# Altium schematic sheet SZG-TEMPLATE-STD.SchDoc: SZG-TEMPLATE-STD
size B; Organization: Opal Kelly; Address1: 13500 SW 72nd Ave STE 100; Address2: Portland, OR  97223; Address3: 217.391.3724; Address4: http://www.opalkelly.com; DocumentNumber: xxx; Revision: 1; SheetNumber: 2; SheetTotal: 3; PageSetup: Record=PageOptions|CenterHorizontal=True|CenterVertical=True|PrintScale=0.52|XCorrection=1.00|YCorrection=1.00|PrintKind=0|BorderSize=5000000|LeftOffset=0|BottomOffset=0|Orientation=2|PaperLength=1000|PaperWidth=1000|Scale=100|PaperSource=7|PrintQuality=-4|MediaType=1|DitherType=10|PaperKind=Letter|PrintScaleMode=1
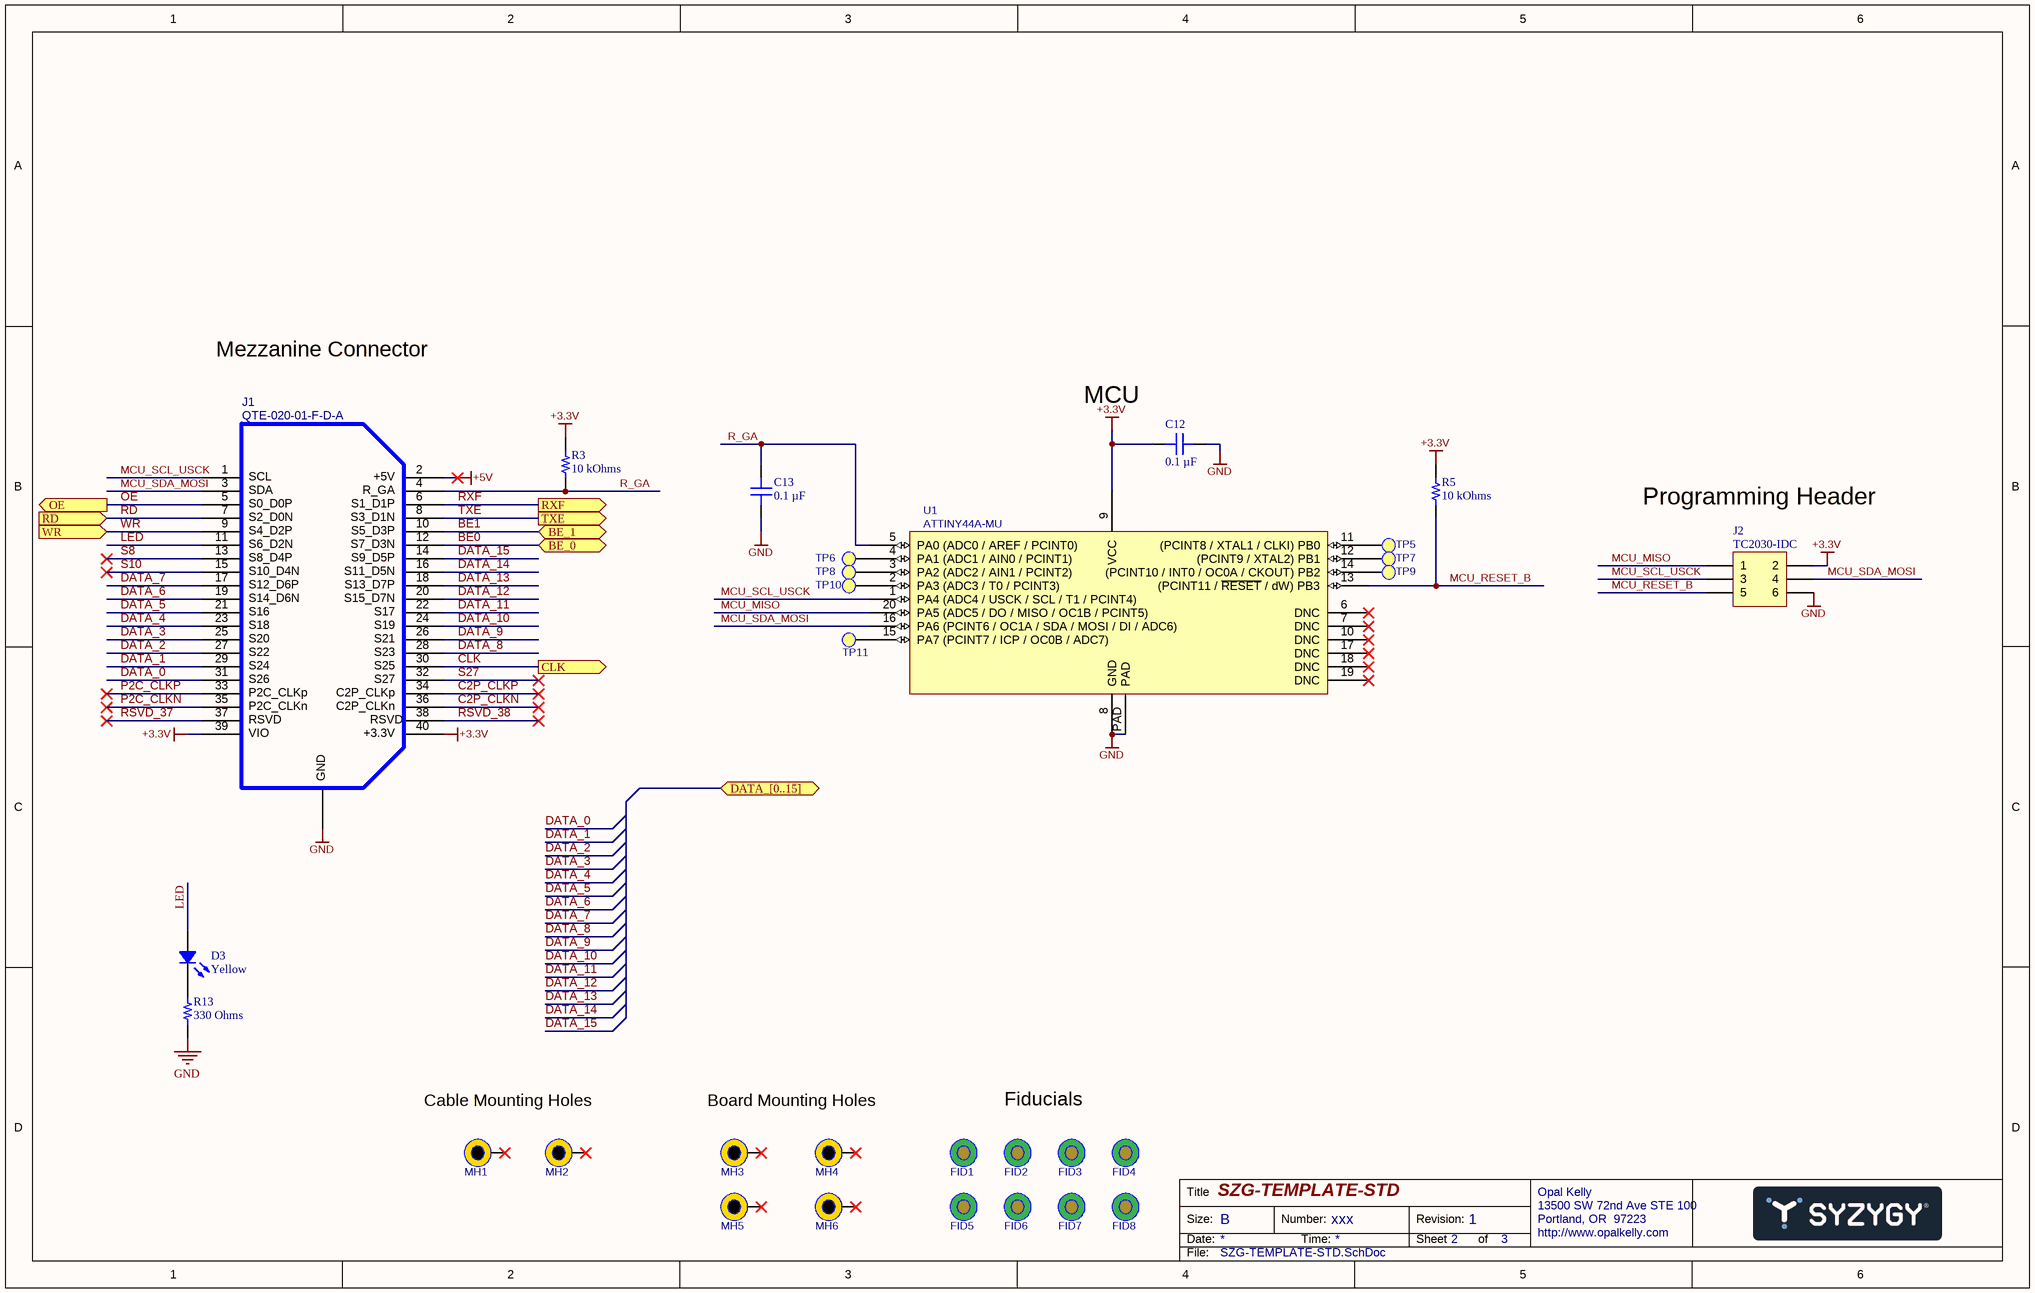
[diagram p0: SZG-TEMPLATE-STD.SchDoc]

## Parts
C12  0.1 µF  [CAP 0201_0603]
C13  0.1 µF  [CAP 0201_0603]
D3  Yellow  [LED 1206_3216 YELLOW]
FID1  FIDUCIAL  [FID1MM/2MM-SS]  (value not drawn)
FID2  FIDUCIAL  [FID1MM/2MM-SS]  (value not drawn)
FID3  FIDUCIAL  [FID1MM/2MM-SS]  (value not drawn)
FID4  FIDUCIAL  [FID1MM/2MM-SS]  (value not drawn)
FID5  FIDUCIAL  [FID1MM/2MM-SS]  (value not drawn)
FID6  FIDUCIAL  [FID1MM/2MM-SS]  (value not drawn)
FID7  FIDUCIAL  [FID1MM/2MM-SS]  (value not drawn)
FID8  FIDUCIAL  [FID1MM/2MM-SS]  (value not drawn)
J1  QTE-020-01-F-D-A  [QTE-020-01-X-D-A-L]
J2  Manufacturer_PN: TC2030-IDC  [TC2030-DUAL]
MH1  MTG  [MTG-3.2/6.5-PTH]  (value not drawn)
MH2  MTG  [MTG-3.2/6.5-PTH]  (value not drawn)
MH3  MTG  [MTG-3.2/6.5-PTH]  (value not drawn)
MH4  MTG  [MTG-3.2/6.5-PTH]  (value not drawn)
MH5  MTG  [MTG-3.2/6.5-PTH]  (value not drawn)
MH6  MTG  [MTG-3.2/6.5-PTH]  (value not drawn)
R3  10 kOhms  [RES 0201_0603]
R5  10 kOhms  [RES 0201_0603]
R13  330 Ohms  [RES 0603_1608]
TP5  TESTPOINT-SMD20  [TP-SMD20]  (value not drawn)
TP6  TESTPOINT-SMD20  [TP-SMD20]  (value not drawn)
TP7  TESTPOINT-SMD20  [TP-SMD20]  (value not drawn)
TP8  TESTPOINT-SMD20  [TP-SMD20]  (value not drawn)
TP9  TESTPOINT-SMD20  [TP-SMD20]  (value not drawn)
TP10  TESTPOINT-SMD20  [TP-SMD20]  (value not drawn)
TP11  TESTPOINT-SMD20  [TP-SMD20]  (value not drawn)
U1  ATTINY44A-MU  [QFN-EP-20]

## Ports
BE_0 (bidir), BE_1 (bidir), CLK (out), DATA_[0..15] (bidir), OE (out), RD (in), RXF (out), TXE (out), WR (in)

## Nets
+3.3V: C12.1 J1.39 J1.40 J2.2 R3.2 R5.2 U1.9(VCC)
+5V: J1.2
GND: C12.2 C13.1 J1.0 J2.6 R13.1 U1.8(GND) U1.PAD
BE0: J1.12 ; port BE_0
BE1: J1.10 ; port BE_1
C2P_CLKN: J1.36
C2P_CLKP: J1.34
CLK: J1.30 ; port CLK
DATA_0: J1.31
DATA_1: J1.29
DATA_2: J1.27
DATA_3: J1.25
DATA_4: J1.23
DATA_5: J1.21
DATA_6: J1.19
DATA_7: J1.17
DATA_8: J1.28
DATA_9: J1.26
DATA_10: J1.24
DATA_11: J1.22
DATA_12: J1.20
DATA_13: J1.18
DATA_14: J1.16
DATA_15: J1.14
LED: D3.1 J1.11
MCU_MISO: J2.1 U1.20(PA5_(ADC5_/_DO_/_MISO_/_OC1B_/_PCINT5))
MCU_RESET_B: J2.5 R5.1 U1.13((PCINT11_/_~{RESET}_/_dW)_PB3)
MCU_SCL_USCK: J1.1 J2.3 U1.1(PA4_(ADC4_/_USCK_/_SCL_/_T1_/_PCINT4))
MCU_SDA_MOSI: J1.3 J2.4 U1.16(PA6_(PCINT6_/_OC1A_/_SDA_/_MOSI_/_DI_/_ADC6))
OE: J1.5 ; port OE
P2C_CLKN: J1.35
P2C_CLKP: J1.33
R_GA: C13.2 J1.4 R3.1 U1.5(PA0_(ADC0_/_AREF_/_PCINT0))
RD: J1.7 ; port RD
RSVD_37: J1.37
RSVD_38: J1.38
RXF: J1.6 ; port RXF
S8: J1.13
S10: J1.15
S27: J1.32
TXE: J1.8 ; port TXE
WR: J1.9 ; port WR
NetD3_2: D3.2 R13.2
NetTP5_1: TP5.1(PIN) U1.11((PCINT8_/_XTAL1_/_CLKI)_PB0)
NetTP6_1: TP6.1(PIN) U1.4(PA1_(ADC1_/_AIN0_/_PCINT1))
NetTP7_1: TP7.1(PIN) U1.12((PCINT9_/_XTAL2)_PB1)
NetTP8_1: TP8.1(PIN) U1.3(PA2_(ADC2_/_AIN1_/_PCINT2))
NetTP9_1: TP9.1(PIN) U1.14((PCINT10_/_INT0_/_OC0A_/_CKOUT)_PB2)
NetTP10_1: TP10.1(PIN) U1.2(PA3_(ADC3_/_T0_/_PCINT3))
NetTP11_1: TP11.1(PIN) U1.15(PA7_(PCINT7_/_ICP_/_OC0B_/_ADC7))

Not connected (* = marked no-connect by the designer): MH1 1*; MH2 1*; MH3 1*; MH4 1*; MH5 1*; MH6 1*; U1 6(DNC)* 7(DNC)* 10(DNC)* 17(DNC)* 18(DNC)* 19(DNC)*

## Notes on the sheet
- Mezzanine Connector
- (near C12) MCU
- Programming Header
- Cable Mounting Holes
- Board Mounting Holes
- Fiducials
- Title
- Size:
- Date:
- B
- Number:
- Time:
- Revision:
- Sheet
- of
- File:
- (in symbol 000973) SCL; +5V; SDA; R_GA; S0_D0P; S1_D1P; S2_D0N; S3_D1N; S4_D2P; S5_D3P; S6_D2N; S7_D3N; S8_D4P; S9_D5P; S10_D4N; S11_D5N; S12_D6P; S13_D7P; S14_D6N; S15_D7N; S16; S17; S18; S19; S20; S21; S22; S23; S24; S25; S26; S27; P2C_CLKp; C2P_CLKp; P2C_CLKn; C2P_CLKn; RSVD; VIO; +3.3V; GND

## Library data of the parts
C12 C13 = EMK063BJ104KP-F: CAP CER 0.1UF 16V X5R 0201; manufacturer: Taiyo Yuden; Tolerance: ±10%; Part Number: EMK063BJ104KP-F; Value: 0.1 µF; Applications: SMPS Filtering; Capacitance: 0.1 µF; componentlink1description: Datasheet; componentlink1url: https://ds.yuden.co.jp/TYCOMPAS/ut/detail?pn=EMK063BJ104KP-F  &u=M; componentlink2description: DigiKey Link; componentlink2url: https://www.digikey.com/en/products/detail/taiyo-yuden/EMK063BJ104KP-F/4970625; Device Package: 0201 (0603 Metric); lastupdated: 12/20/2023 8:01:02 PM; Lifecycle Status: Active; Minimum Order: 1; Mounting Type: Surface Mount, MLCC; Operating Temperature: -55°C ~ 85°C; Package / Case: 0201 (0603 Metric); packaging: TapeAndReel; partid: 12; Part Status: Active; price: 0.01; series: M; Size / Dimension: 0.024" L x 0.012" W (0.60mm x 0.30mm); Supplier 1: DigiKey; Supplier Part Number 1: 587-5833-1-ND; Temperature Coefficient: X5R; Thickness (Max): 0.013" (0.33mm); Voltage - Rated: 16V
D3 = CMD11-21VYC/TR8: LED YELLOW CLEAR 1206 SMD; Manufacturer: Visual Communications Company - VCC; Configuration: Standard; Current - Test: 20mA; Lens Color: 1.50mm; Lens Size: 1.10mm Dia; Lens Style: Round with Flat Top; Millicandela Rating: 6mcd; Viewing Angle: 20°; Voltage - Forward (Vf) (Typ): 2V; Wavelength - Peak: 585nm; Part Number: CMD11-21VYC/TR8; Color: Yellow; ComponentLink1Description: Datasheet; ComponentLink1URL: https://vcclite.com/wp-content/uploads/wpallimport/files/files/CMD11-21%20SMT%20LEDs%201206%20Package%20Size.pdf; ComponentLink2Description: DigiKey Link; ComponentLink2URL: https://www.digikey.com/en/products/detail/visual-communications-company-vcc/CMD11-21VYC-TR8/254830; Device Package: 1206 (3216 Metric); Height (Max): 1.50mm; LastUpdated: 12/21/2023 9:31:44 PM; Lens Transparency: Clear; Lifecycle Status: Active; Minimum Order: 1; Mounting Type: Surface Mount; Package / Case: 1206 (3216 Metric); Packaging: TapeAndReel; PartId: 6; Part Status: Active; Price: 0.22; Series: -; Size / Dimension: 3.00mm L x 1.50mm W; Supplier 1: DigiKey; Supplier Part Number 1: 28-CMD11-21VYC/TR8CT-ND; Supplier Device Package: 1206; Value: Yellow
FID1-FID8 = FIDUCIAL: PCB fiducial
J1 = 000973: Partnumber: 000973; manufacturer: Samtec; id: 24153; inventory_price: 3.86; created_on: 4/3/2013 1:34:16 PM; manufacturer_pn: QTE-020-01-F-D-A; parttype: Connector; rohs: 1; updated_on: 2/26/2018 2:13:14 PM
J2 = 002062: Tag-Connect 6-pin Plug-of-Nails spring-pin cable footprint; AligniPartNumber: 002062; Manufacturer: Tag-Connect; parttype: Connector
MH1-MH6 = MTG: Mounting hole
R3 R5 = CRCW020110K0FKED: RES SMD 10K OHM 1% 1/20W 0201; Manufacturer: Vishay Dale; Power (Watts): 0.05W, 1/20W; Temperature Coefficient: ±100ppm/°C; Part Number: CRCW020110K0FKED; Value: 10 kOhms; ComponentLink1Description: Datasheet; ComponentLink1URL: http://www.vishay.com/docs/20052/crcw0201e3.pdf; ComponentLink2Description: DigiKey Link; ComponentLink2URL: https://www.digikey.com/en/products/detail/vishay-dale/CRCW020110K0FKED/1967989; Composition: Thick Film; Device Package: 0201 (0603 Metric); Height - Seated (Max): 0.010" (0.26mm); LastUpdated: 12/20/2023 8:19:32 PM; Lifecycle Status: Active; Minimum Order: 1; Number of Terminations: 2; Operating Temperature: -55°C ~ 155°C; Package / Case: 0201 (0603 Metric); Packaging: TapeAndReel; PartId: 29; Part Status: Active; Price: 0.02; Resistance: 10 kOhms; Series: CRCW; Size / Dimension: 0.024" L x 0.012" W (0.60mm x 0.30mm); Supplier 1: DigiKey; Supplier Part Number 1: 541-10.0KAABCT-ND; Supplier Device Package: 0201; Tolerance: ±1%
R13 = CMP0603AFX-3300ELF: RESHIGHPOWERA 0603 330R 1% 1/4W; Manufacturer: Bourns Inc.; Power (Watts): 0.25W, 1/4W; Temperature Coefficient: ±100ppm/°C; Part Number: CMP0603AFX-3300ELF; Value: 330 Ohms; ComponentLink1Description: Datasheet; ComponentLink1URL: https://www.bourns.com/docs/Product-Datasheets/CMP-A.pdf; ComponentLink2Description: DigiKey Link; ComponentLink2URL: https://www.digikey.com/en/products/detail/bourns-inc/CMP0603AFX-3300ELF/12333647; Composition: Thick Film; Device Package: 0603 (1608 Metric); Features: Anti-Sulfur, Automotive AEC-Q200, Moisture Resistant, Pulse Withstanding; Height - Seated (Max): 0.022" (0.55mm); LastUpdated: 12/26/2023 8:37:22 PM; Lifecycle Status: Active; Minimum Order: 1; Number of Terminations: 2; Operating Temperature: -55°C ~ 155°C; Package / Case: 0603 (1608 Metric); Packaging: TapeAndReel; PartId: 62133; Part Status: Active; Price: 0.02; Ratings: AEC-Q200; Resistance: 330 Ohms; Series: CMP-A; Size / Dimension: 0.063" L x 0.031" W (1.60mm x 0.80mm); Supplier 1: DigiKey; Supplier Part Number 1: 118-CMP0603AFX-3300ELFCT-ND; Supplier Device Package: 0603; Tolerance: ±1%
TP5-TP11 = TESTPOINT-SMD20: Test point, surface-mount, 20mil
U1 = 001552: 8-bit MCU, 4 KB flash, 256 bytes EEPROM; Manufacturer: Microchip; partnumber: 001552; x_lifecycle_status: Production; Manufacturer_PN: ATTINY44A-MU; updated_on: 5/23/2017 10:51:21 AM